# Altium schematic sheet 原理图.SchDoc
size A4; Address1: 天空星V3.0; Address2: BMS实验室; Address3: 蔡徐坤; Address4: i坤小队001; SheetNumber: 1; SheetTotal: 1
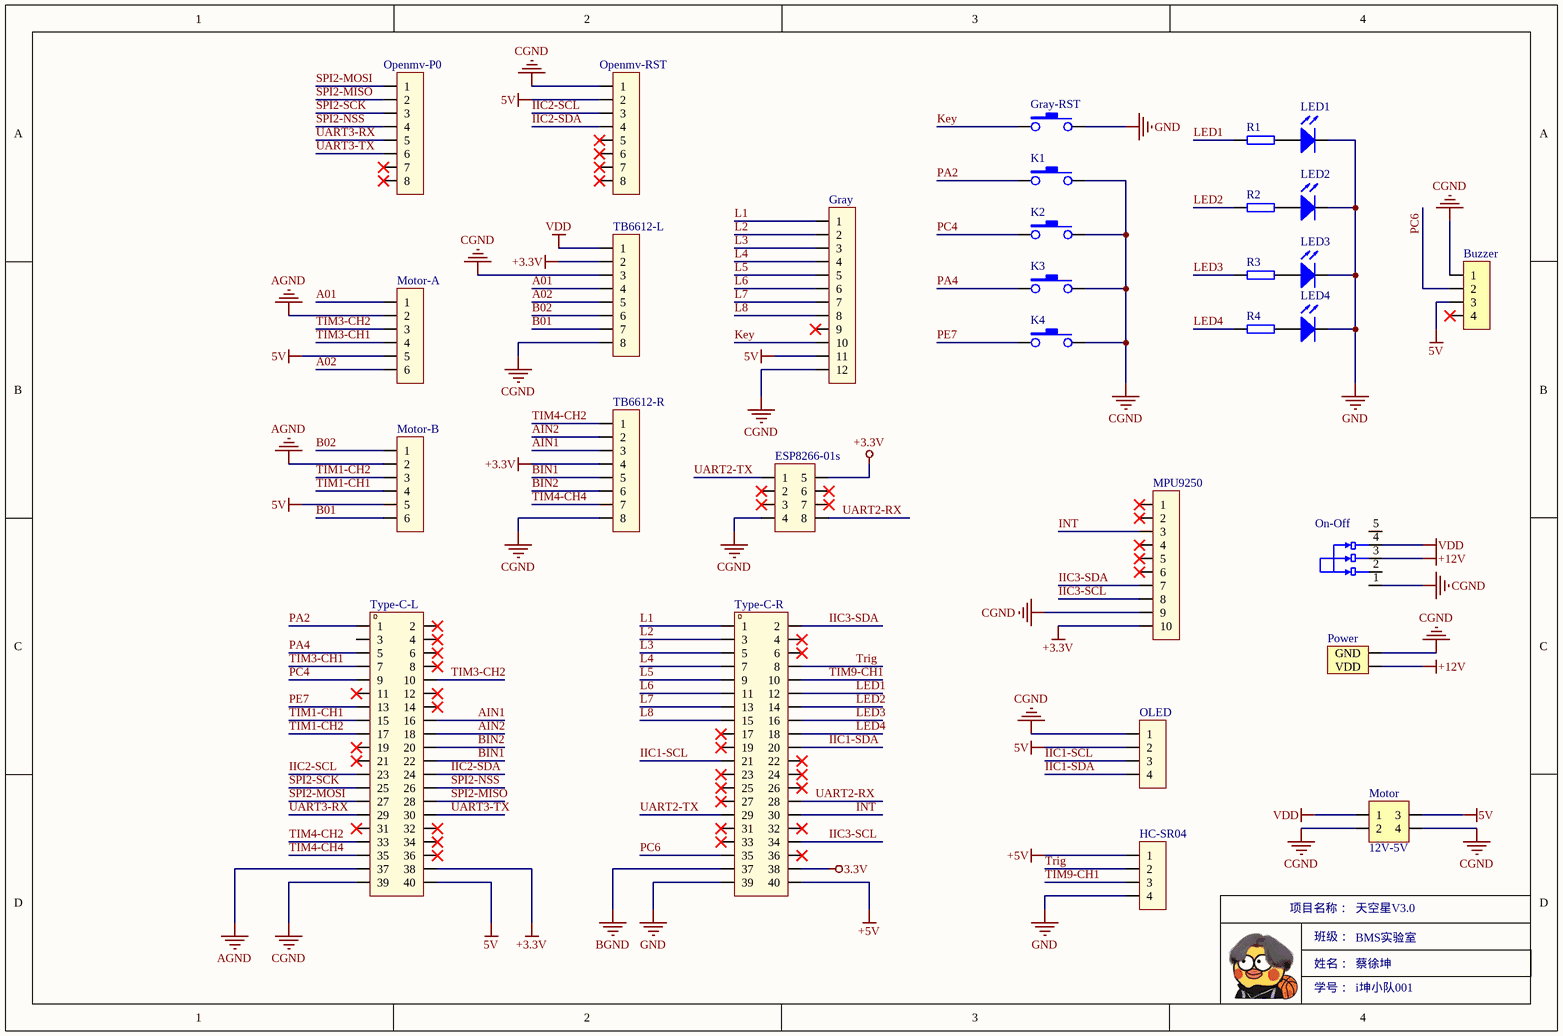
[diagram p0: 原理图.SchDoc]

## Parts
Buzzer  (no value)  [HDR2.54-M-LI-4P]
ESP8266-01s  (no value)  [ESP8266-01s]
Gray  (no value)  [XH2.54-1*12P]
Gray-RST  (no value)  [贴片按键8mm]
HC-SR04  (no value)  [HC-SR04]
K1  (no value)  [贴片按键8mm]
K2  (no value)  [贴片按键8mm]
K3  (no value)  [贴片按键8mm]
K4  (no value)  [贴片按键8mm]
LED1  (no value)  [LED-3mm]
LED2  (no value)  [LED-3mm]
LED3  (no value)  [LED-3mm]
LED4  (no value)  [LED-3mm]
Motor  12V-5V  [12V-5V-Blue]
Motor-A  (no value)  [XH2.54-1*6P直]
Motor-B  (no value)  [XH2.54-1*6P直]
MPU9250  (no value)  [MPU9250]
OLED  (no value)  [OLED]
On-Off  (no value)  [拨动开关]
Openmv-P0  (no value)  [XH2.54-1*8P]
Openmv-RST  (no value)  [XH2.54-1*8P]
Power  (no value)  [立插端子-2P]
R1  (no value)  [120Ω]
R2  (no value)  [120Ω]
R3  (no value)  [120Ω]
R4  (no value)  [120Ω]
TB6612-L  (no value)  [排母-1*8P]
TB6612-R  (no value)  [排母-1*8P]
Type-C-L  (no value)  [排母2*20P]
Type-C-R  (no value)  [排母2*20P]

## Nets
3.3V: Type-C-R.38
5V: Buzzer.3 Gray.11 Motor.3 Motor-A.5 Motor-B.5 OLED.2 Openmv-RST.2 Type-C-L.40
+3.3V: ESP8266-01s.5 MPU9250.10 TB6612-L.2 TB6612-R.4 Type-C-L.38
+5V: HC-SR04.1 Type-C-R.40
+12V: On-Off.3 Power.1(VDD)
AGND: Motor-A.2 Motor-B.2 Type-C-L.37
BGND: Type-C-R.37
CGND: Buzzer.1 ESP8266-01s.4 Gray.12 K1.2 K2.2 K3.2 K4.2 Motor.2 Motor.4 MPU9250.9 OLED.1 On-Off.1 Openmv-RST.1 Power.2(GND) TB6612-L.3 TB6612-L.8 TB6612-R.8 Type-C-L.39
GND: Gray-RST.2 HC-SR04.4 LED1.2(K) LED2.2(K) LED3.2(K) LED4.2(K) Type-C-R.39
VDD: Motor.1 On-Off.4 TB6612-L.1
A01: Motor-A.1 TB6612-L.4
A02: Motor-A.6 TB6612-L.5
AIN1: TB6612-R.3 Type-C-L.16
AIN2: TB6612-R.2 Type-C-L.18
B01: Motor-B.6 TB6612-L.7
B02: Motor-B.1 TB6612-L.6
BIN1: TB6612-R.5 Type-C-L.22
BIN2: TB6612-R.6 Type-C-L.20
IIC1-SCL: OLED.3 Type-C-R.21
IIC1-SDA: OLED.4 Type-C-R.20
IIC2-SCL: Openmv-RST.3 Type-C-L.23
IIC2-SDA: Openmv-RST.4 Type-C-L.24
IIC3-SCL: MPU9250.8 Type-C-R.34
IIC3-SDA: MPU9250.7 Type-C-R.2
INT: MPU9250.3 Type-C-R.30
Key: Gray.10 Gray-RST.1
L1: Gray.1 Type-C-R.1
L2: Gray.2 Type-C-R.3
L3: Gray.3 Type-C-R.5
L4: Gray.4 Type-C-R.7
L5: Gray.5 Type-C-R.9
L6: Gray.6 Type-C-R.11
L7: Gray.7 Type-C-R.13
L8: Gray.8 Type-C-R.15
LED1: R1.1 Type-C-R.12
LED2: R2.1 Type-C-R.14
LED3: R3.1 Type-C-R.16
LED4: R4.1 Type-C-R.18
PA2: K1.1 Type-C-L.1
PA4: K3.1 Type-C-L.5
PC4: K2.1 Type-C-L.9
PC6: Buzzer.2 Type-C-R.35
PE7: K4.1 Type-C-L.13
SPI2-MISO: Openmv-P0.2 Type-C-L.28
SPI2-MOSI: Openmv-P0.1 Type-C-L.27
SPI2-NSS: Openmv-P0.4 Type-C-L.26
SPI2-SCK: Openmv-P0.3 Type-C-L.25
TIM1-CH1: Motor-B.4 Type-C-L.15
TIM1-CH2: Motor-B.3 Type-C-L.17
TIM3-CH1: Motor-A.4 Type-C-L.7
TIM3-CH2: Motor-A.3 Type-C-L.10
TIM4-CH2: TB6612-R.1 Type-C-L.33
TIM4-CH4: TB6612-R.7 Type-C-L.35
TIM9-CH1: HC-SR04.3 Type-C-R.10
Trig: HC-SR04.2 Type-C-R.8
UART2-RX: ESP8266-01s.8 Type-C-R.28
UART2-TX: ESP8266-01s.1 Type-C-R.29
UART3-RX: Openmv-P0.5 Type-C-L.29
UART3-TX: Openmv-P0.6 Type-C-L.30
NetLED1_1: LED1.1(A) R1.2
NetLED2_1: LED2.1(A) R2.2
NetLED3_1: LED3.1(A) R3.2
NetLED4_1: LED4.1(A) R4.2

Not connected (* = marked no-connect by the designer): Buzzer 4*; ESP8266-01s 2* 3* 6* 7*; Gray 9*; MPU9250 1* 2* 4* 5* 6*; On-Off 2 5; Openmv-P0 7* 8*; Openmv-RST 5* 6* 7* 8*; Type-C-L 2* 3 4* 6* 8* 11* 12* 14* 19* 21* 31* 32* 34* 36*; Type-C-R 4* 6* 17* 19* 22* 23* 24* 25* 26* 27* 31* 32* 33* 36*

## Notes on the sheet
- 项目名称：
- 班级：
- 姓名：
- 学号：

## Library data of the parts
Buzzer = Header 4: 4P接插件; 版权归属: 源创客; BOM名称: 4P接插件; 学习资源: www.ooocke.com
ESP8266-01s = 2*4P: 2*4P排母
Gray = 1*12P: 1*12P排母
Gray-RST K1-K4 = Button-12X12-pin2: 12x12按键
HC-SR04 OLED = 1*4P: 1*4P排母
LED1-LED4 = D-LED-M3: 普通M3发光二极管
Motor = 12V转5V: 降压模块12V转5V
Motor-A Motor-B = 1*6P: 1*6P排母
MPU9250 = 1*10P: 1*10P排母
On-Off = 拨动开关: 2.54mm间距，拨动开关
Openmv-P0 Openmv-RST TB6612-L TB6612-R = 1*8P: 1*8P排母
Power = Power: 电源引脚
R1-R4 = R-0805: 1206
Type-C-L Type-C-R = 2*20P: 2*20P排母